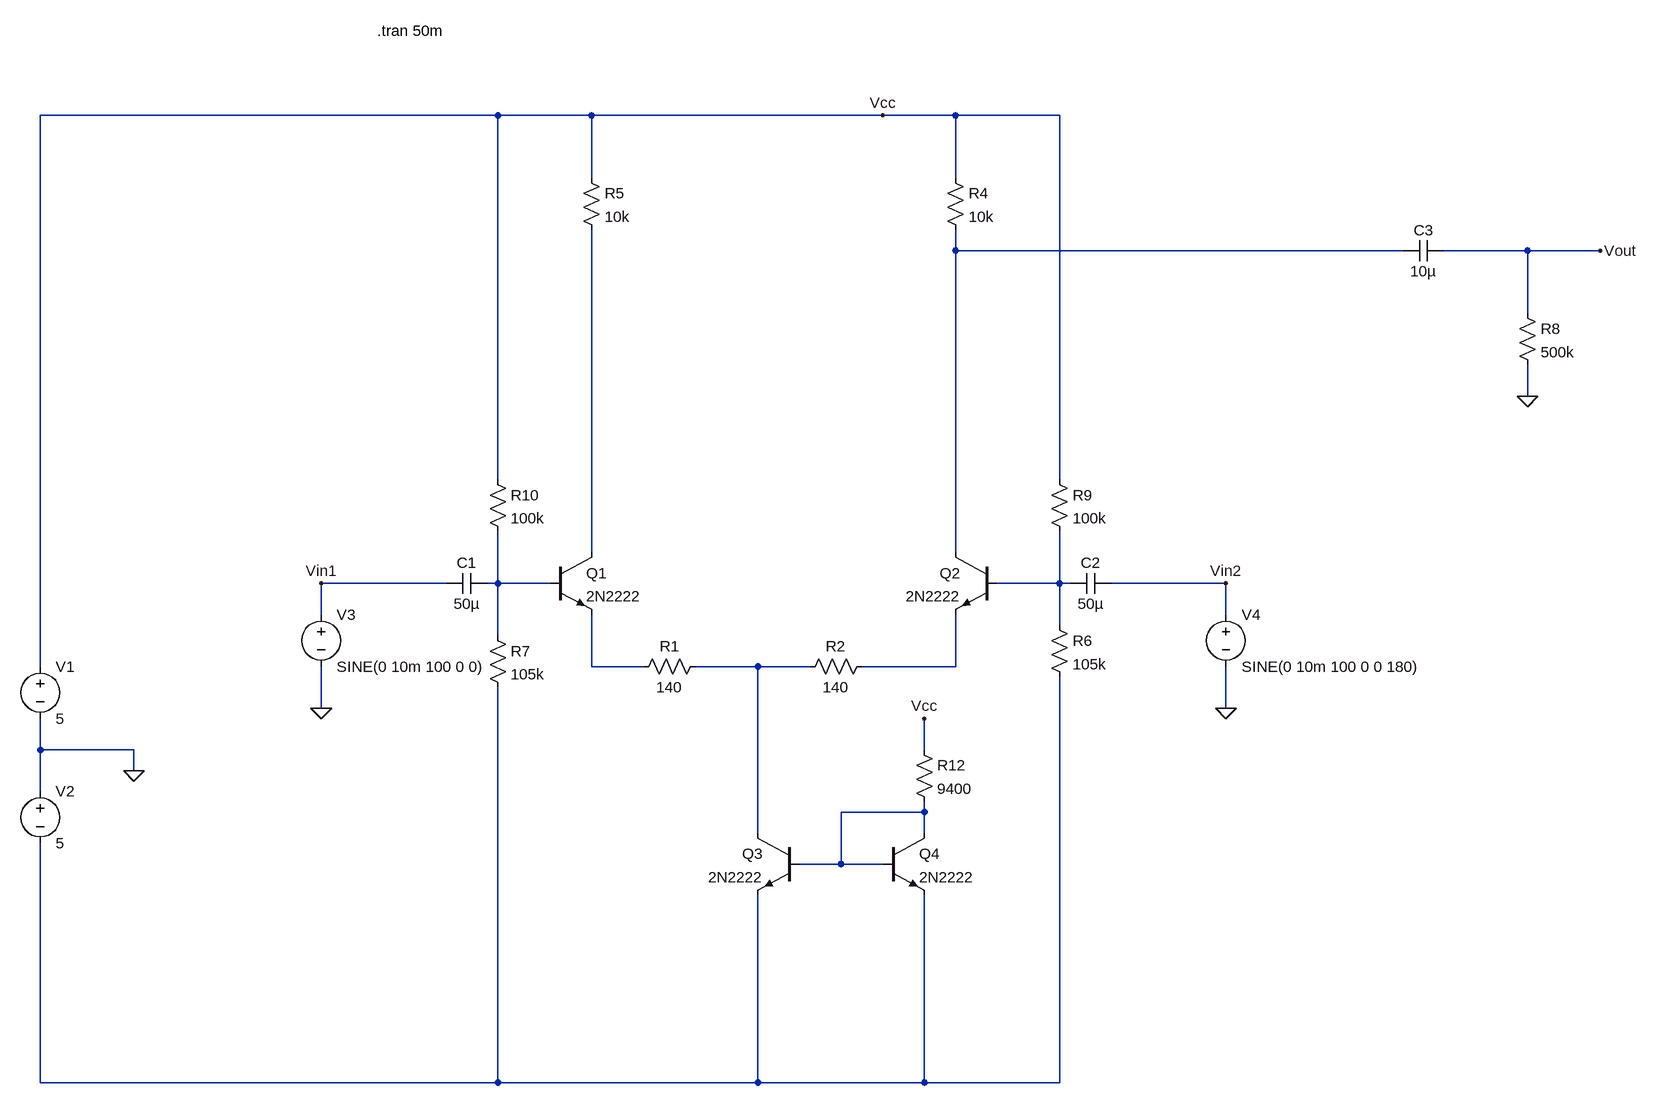
[diagram p0: schematic Draft2.asc]
Draft2.asc, the LTspice schematic file:
Version 4
SHEET 1 1768 1384
WIRE 0 -112 -704 -112
WIRE 144 -112 0 -112
WIRE 592 -112 144 -112
WIRE 704 -112 592 -112
WIRE 864 -112 704 -112
WIRE 144 -16 144 -112
WIRE 704 -16 704 -112
WIRE 704 96 704 64
WIRE 1392 96 704 96
WIRE 1584 96 1456 96
WIRE 1696 96 1584 96
WIRE 1584 192 1584 96
WIRE 1584 320 1584 272
WIRE 0 448 0 -112
WIRE 864 448 864 -112
WIRE 144 560 144 64
WIRE 704 560 704 96
WIRE -80 608 -272 608
WIRE 0 608 0 528
WIRE 0 608 -16 608
WIRE 80 608 0 608
WIRE 864 608 864 528
WIRE 864 608 768 608
WIRE 880 608 864 608
WIRE 1120 608 944 608
WIRE -272 656 -272 608
WIRE 1120 656 1120 608
WIRE 864 672 864 608
WIRE 0 688 0 608
WIRE -704 736 -704 -112
WIRE 144 736 144 656
WIRE 224 736 144 736
WIRE 400 736 304 736
WIRE 480 736 400 736
WIRE 704 736 704 656
WIRE 704 736 560 736
WIRE -272 800 -272 736
WIRE 1120 800 1120 736
WIRE -704 864 -704 816
WIRE -560 864 -704 864
WIRE 656 864 656 816
WIRE -560 896 -560 864
WIRE -704 928 -704 864
WIRE 656 960 656 944
WIRE 656 960 528 960
WIRE 400 992 400 736
WIRE 656 992 656 960
WIRE 528 1040 528 960
WIRE 528 1040 464 1040
WIRE 592 1040 528 1040
WIRE -704 1376 -704 1008
WIRE 0 1376 0 768
WIRE 0 1376 -704 1376
WIRE 400 1376 400 1088
WIRE 400 1376 0 1376
WIRE 656 1376 656 1088
WIRE 656 1376 400 1376
WIRE 864 1376 864 752
WIRE 864 1376 656 1376
FLAG 1696 96 Vout
FLAG -560 896 0
FLAG -272 800 0
FLAG 1120 800 0
FLAG 1584 320 0
FLAG -272 608 Vin1
FLAG 1120 608 Vin2
FLAG 592 -112 Vcc
FLAG 656 816 Vcc
DATAFLAG 800 608 ""
SYMBOL npn 80 560 R0
SYMATTR InstName Q1
SYMATTR Value 2N2222
SYMBOL npn 768 560 M0
SYMATTR InstName Q2
SYMATTR Value 2N2222
SYMBOL res 320 720 R90
WINDOW 0 0 56 VBottom 2
WINDOW 3 32 56 VTop 2
SYMATTR InstName R1
SYMATTR Value 140
SYMBOL res 576 720 R90
WINDOW 0 0 56 VBottom 2
WINDOW 3 32 56 VTop 2
SYMATTR InstName R2
SYMATTR Value 140
SYMBOL res 688 -32 R0
SYMATTR InstName R4
SYMATTR Value 10k
SYMBOL res 128 -32 R0
SYMATTR InstName R5
SYMATTR Value 10k
SYMBOL voltage -704 720 R0
SYMATTR InstName V1
SYMATTR Value 5
SYMBOL res 848 656 R0
SYMATTR InstName R6
SYMATTR Value 105k
SYMBOL res -16 672 R0
SYMATTR InstName R7
SYMATTR Value 105k
SYMBOL cap -16 592 R90
WINDOW 0 0 32 VBottom 2
WINDOW 3 32 32 VTop 2
SYMATTR InstName C1
SYMATTR Value 50µ
SYMBOL cap 944 592 R90
WINDOW 0 0 32 VBottom 2
WINDOW 3 32 32 VTop 2
SYMATTR InstName C2
SYMATTR Value 50µ
SYMBOL voltage -704 912 R0
SYMATTR InstName V2
SYMATTR Value 5
SYMBOL voltage -272 640 R0
WINDOW 123 0 0 Left 0
WINDOW 39 0 0 Left 0
SYMATTR InstName V3
SYMATTR Value SINE(0 10m 100 0 0)
SYMBOL voltage 1120 640 R0
WINDOW 123 0 0 Left 0
WINDOW 39 0 0 Left 0
SYMATTR InstName V4
SYMATTR Value SINE(0 10m 100 0 0 180)
SYMBOL res 1568 176 R0
SYMATTR InstName R8
SYMATTR Value 500k
SYMBOL cap 1456 80 R90
WINDOW 0 0 32 VBottom 2
WINDOW 3 32 32 VTop 2
SYMATTR InstName C3
SYMATTR Value 10µ
SYMBOL res 848 432 R0
SYMATTR InstName R9
SYMATTR Value 100k
SYMBOL res -16 432 R0
SYMATTR InstName R10
SYMATTR Value 100k
SYMBOL npn 464 992 M0
SYMATTR InstName Q3
SYMATTR Value 2N2222
SYMBOL npn 592 992 R0
SYMATTR InstName Q4
SYMATTR Value 2N2222
SYMBOL res 640 848 R0
SYMATTR InstName R12
SYMATTR Value 9400
TEXT -186 -242 Left 2 !.tran 50m

The netlist it stands for:
* Draft2.asc
Q1 N002 N003 N005 0 2N2222
Q2 N001 N004 N007 0 2N2222
R1 N006 N005 140
R2 N007 N006 140
R4 Vcc N001 10k
R5 Vcc N002 10k
V1 Vcc 0 5
R6 N004 N009 105k
R7 N003 N009 105k
C1 N003 Vin1 50µ
C2 Vin2 N004 50µ
V2 0 N009 5
V3 Vin1 0 SINE(0 10m 100 0 0)
V4 Vin2 0 SINE(0 10m 100 0 0 180)
R8 Vout 0 500k
C3 Vout N001 10µ
R9 Vcc N004 100k
R10 Vcc N003 100k
Q3 N006 N008 N009 0 2N2222
Q4 N008 N008 N009 0 2N2222
R12 Vcc N008 9400
.model NPN NPN
.model PNP PNP
.lib standard.bjt
.tran 50m
.backanno
.end